# Altium schematic sheet Sheet1.SchDoc
size A
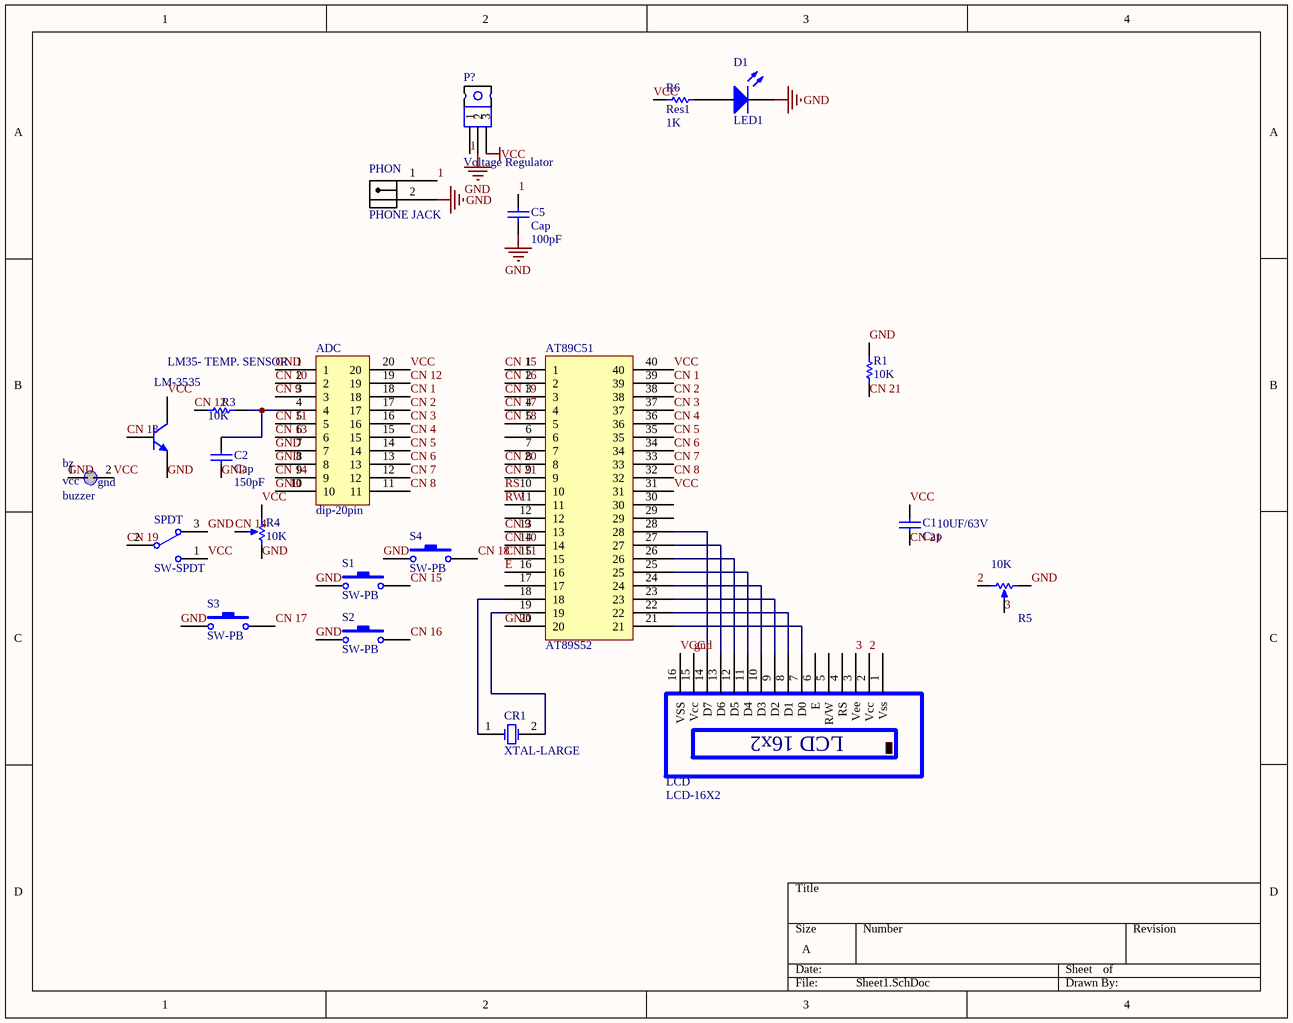
[diagram p0: Sheet1.SchDoc]

## Parts
10K  R5  [reg-variable]
35  LM35- TEMP. SENSOR  [LM35_TEMP SENSOR]
ADC  dip-20pin  [dip-20pin]
AT89C51  AT89S52  [AT89S52]
bz  buzzer  [buzzer]
C1  Cap  value 10UF/63V  [CAP]
C2  Cap  value 150pF  [CAP]
C5  Cap  value 100pF  [RAD-0.3]
CR1  XTAL-LARGE  [XTAL-LARGE]
D1  LED1  [LED-1]
LCD  LCD-16X2  [LCD-16x2]
P?  Voltage Regulator  [7805 WITH HEAT-SINK]
PHON  PHONE JACK  [PHONE JACK]
R1  10K  [res- 2.54x3]
R3  10K  [res- 2.54x3]
R4  10K  [reg-variable]
R6  Res1  value 1K  [AXIAL-0.3]
S1  SW-PB  [sw-pb]
S2  SW-PB  [sw-pb]
S3  SW-PB  [sw-pb]
S4  SW-PB  [sw-pb]
SPDT  SW-SPDT  [TL36WW15050]

## Nets
GND: 10K.3(BOT) 35.1(E) ADC.1 ADC.7 ADC.8 ADC.10 AT89C51.20 bz.1(vcc) C2.1 C5.1 D1.2(K) LCD.15(Vcc) P?.2 PHON.2 R1.2 R4.3(BOT) S1.1 S2.1 S3.1 S4.1 SPDT.3
VCC: 35.3(C) ADC.20 AT89C51.31 AT89C51.40 bz.2(gnd) C1.2 LCD.16(VSS) P?.3 R4.1(TOP) R6.1 SPDT.1
1: C5.2 P?.1 PHON.1
2: 10K.1(TOP) LCD.2(Vcc)
3: 10K.2(TAP) LCD.3(Vee)
CN 1: ADC.18 AT89C51.39
CN 2: ADC.17 AT89C51.38
CN 3: ADC.16 AT89C51.37
CN 4: ADC.15 AT89C51.36
CN 5: ADC.14 AT89C51.35
CN 6: ADC.13 AT89C51.34
CN 7: ADC.12 AT89C51.33
CN 8: ADC.11 AT89C51.32
CN 9: ADC.3 AT89C51.13
CN 10: ADC.2 AT89C51.14
CN 11: ADC.5 AT89C51.15
CN 12: ADC.19 R3.1
CN 13: 35.2(B) ADC.6
CN 14: ADC.9 R4.2(TAP)
CN 15: AT89C51.1 S1.2
CN 16: AT89C51.2 S2.2
CN 17: AT89C51.4 S3.2
CN 18: AT89C51.5 S4.2
CN 19: AT89C51.3 SPDT.2
CN 20: AT89C51.8
CN 21: AT89C51.9 C1.1 R1.1
E: AT89C51.16
RS: AT89C51.10
RW: AT89C51.11
NetADC_4: ADC.4 C2.2 R3.2
NetAT89C51_18: AT89C51.18 CR1.1(OSC1)
NetAT89C51_19: AT89C51.19 CR1.2(OSC2)
NetAT89C51_21: AT89C51.21 LCD.7(D0)
NetAT89C51_22: AT89C51.22 LCD.8(D1)
NetAT89C51_23: AT89C51.23 LCD.9(D2)
NetAT89C51_24: AT89C51.24 LCD.10(D3)
NetAT89C51_25: AT89C51.25 LCD.11(D4)
NetAT89C51_26: AT89C51.26 LCD.12(D5)
NetAT89C51_27: AT89C51.27 LCD.13(D6)
NetAT89C51_28: AT89C51.28 LCD.14(D7)
NetD1_1: D1.1(A) R6.2

Not connected (* = marked no-connect by the designer): AT89C51 6 7 12 17 29 30; LCD 1(Vss) 4(RS) 5(R/W) 6(E)

## Notes on the sheet
- (in symbol LCD-16X2) LCD 16x2
- (in symbol LM35- TEMP. SENSOR) LM-35

## Library data of the parts
10K R4 = Variable Resistor
C1 C2 C5 = Cap: Capacitor; Published: 8-Jun-2000; LatestRevisionDate: 17-Jul-2002; LatestRevisionNote: Re-released for DXP Platform.; PackageReference: RAD-0.3; Publisher: Altium Limited
CR1 = XTAL-LARGE: Crystal Oscillator; Published: 8-Jun-2000; LatestRevisionDate: 17-Jul-2002; LatestRevisionNote: Re-released for DXP Platform.; PackageReference: R38; Publisher: Altium Limited
D1 = LED1: Typical RED GaAs LED; Published: 8-Jun-2000; LatestRevisionDate: 08-Jul-2005; LatestRevisionNote: Mech Layer 1 removed.; PackageReference: LED-1; Publisher: Altium Limited
P? = 7805 WITH HEATSINK
R1 R3 = Resistor 2.54x3
R6 = Res1: Resistor; Published: 8-Jun-2000; LatestRevisionDate: 17-Jul-2002; LatestRevisionNote: Re-released for DXP Platform.; PackageReference: AXIAL-0.3; Publisher: Altium Limited
S1-S4 = SW-PB: Switch; Published: 24-Mar-1999; LatestRevisionDate: 17-Jul-2002; LatestRevisionNote: Re-released for DXP Platform.; PackageReference: SPST-2; Publisher: Altium Limited
SPDT = SW-SPDT: SPDT Subminiature Toggle Switch, Right Angle Mounting, Vertical Actuation; Published: 24-Mar-1999; LatestRevisionDate: 17-Dec-2003; LatestRevisionNote: Schematic revised, PCB Footprint replaced.; DatasheetVersion: 05-Dec-2000; PackageReference: TL36WW15050; Publisher: Altium Limited; ComponentLink1Description: Manufacturer Link; ComponentLink1URL: http://www.apem.com